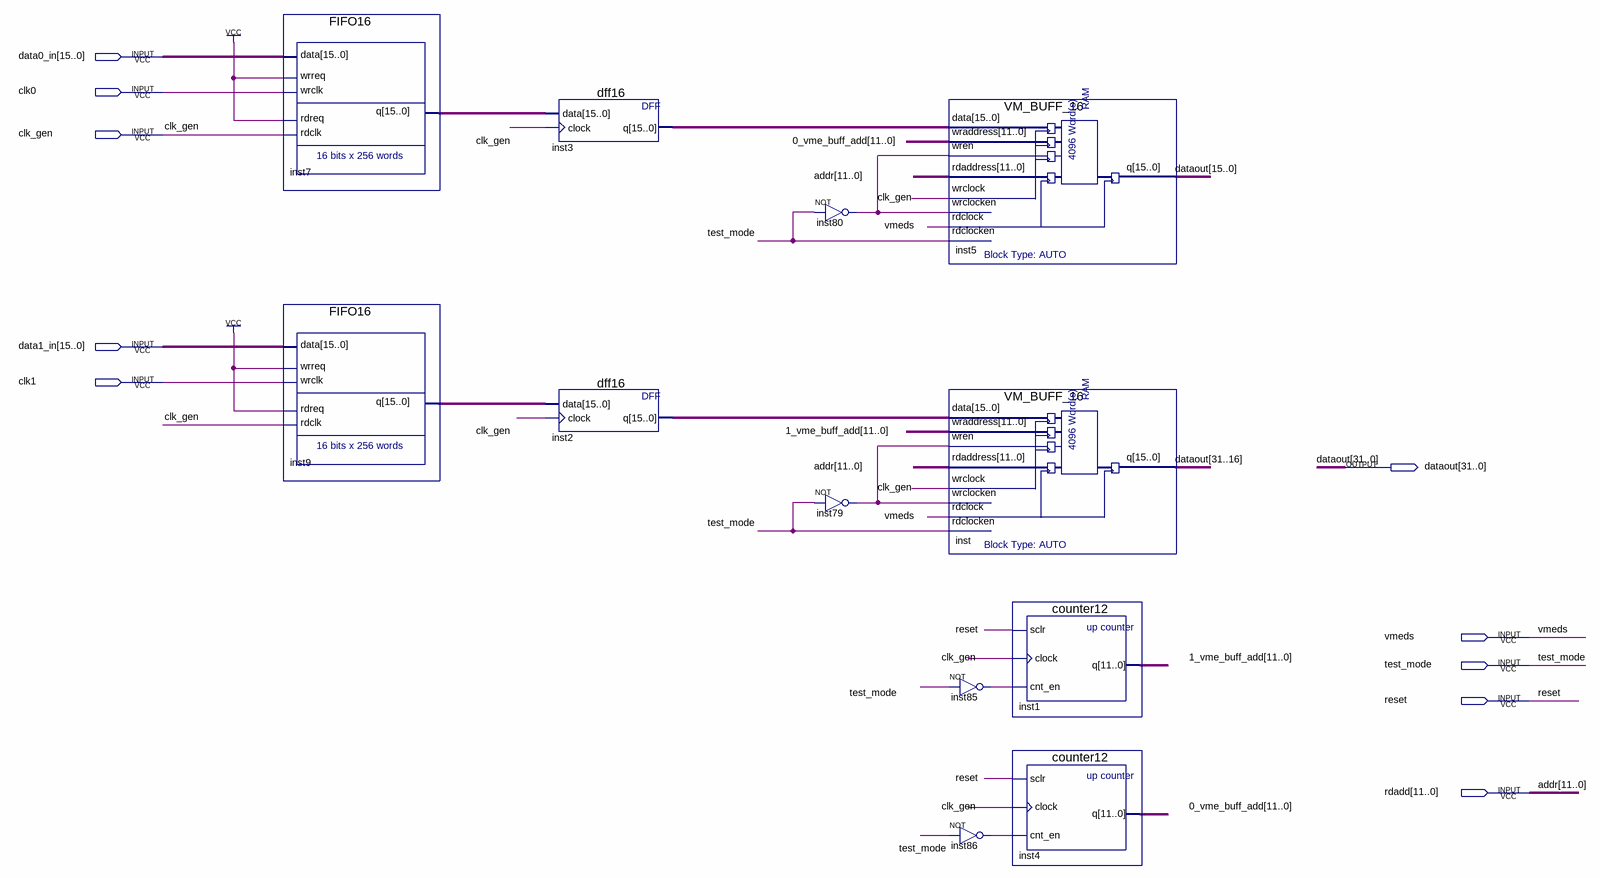
[diagram p0: schematic sheet]
// Quartus schematic VME_Buff_Block.bdf as structural Verilog: 12 symbols, 10 pins
module VME_Buff_Block (
  input  [15:0] data0_in,
  input  clk0,
  input  clk_gen,
  input  [15:0] data1_in,
  input  clk1,
  input  vmeds,
  input  test_mode,
  input  reset,
  input  [11:0] rdadd,
  output [31:0] dataout
);

  wire inst79_out, inst80_out, inst85_out, inst86_out;
  wire [11:0] \0_vme_buff_add , \1_vme_buff_add ;
  wire [15:0] inst2_q, inst3_q, inst7_q, inst9_q;

  FIFO16 inst7 (.data(data0_in), .wrreq(1'b1), .wrclk(clk0), .rdreq(1'b1), .rdclk(clk_gen), .q(inst7_q));
  FIFO16 inst9 (.data(data1_in), .wrreq(1'b1), .wrclk(clk1), .rdreq(1'b1), .rdclk(clk_gen), .q(inst9_q));
  dff16 inst3 (.data(inst7_q), .clock(clk_gen), .q(inst3_q));
  dff16 inst2 (.data(inst9_q), .clock(clk_gen), .q(inst2_q));
  not inst80 (inst80_out, test_mode);
  not inst79 (inst79_out, test_mode);
  VM_BUFF_16 inst5 (
    .data(inst3_q), .wraddress(\0_vme_buff_add ), .wren(inst80_out), .rdaddress(rdadd), .wrclock(clk_gen),
    .wrclocken(inst80_out), .rdclock(vmeds), .rdclocken(test_mode), .q(dataout[15:0]));
  VM_BUFF_16 inst (
    .data(inst2_q), .wraddress(\1_vme_buff_add ), .wren(inst79_out), .rdaddress(rdadd), .wrclock(clk_gen),
    .wrclocken(inst79_out), .rdclock(vmeds), .rdclocken(test_mode), .q(dataout[31:16]));
  not inst85 (inst85_out, test_mode);
  not inst86 (inst86_out, test_mode);
  counter12 inst1 (.sclr(reset), .clock(clk_gen), .cnt_en(inst85_out), .q(\1_vme_buff_add ));
  counter12 inst4 (.sclr(reset), .clock(clk_gen), .cnt_en(inst86_out), .q(\0_vme_buff_add ));

  // Other names for the same wires on the sheet: addr[11:0] = rdadd
endmodule
